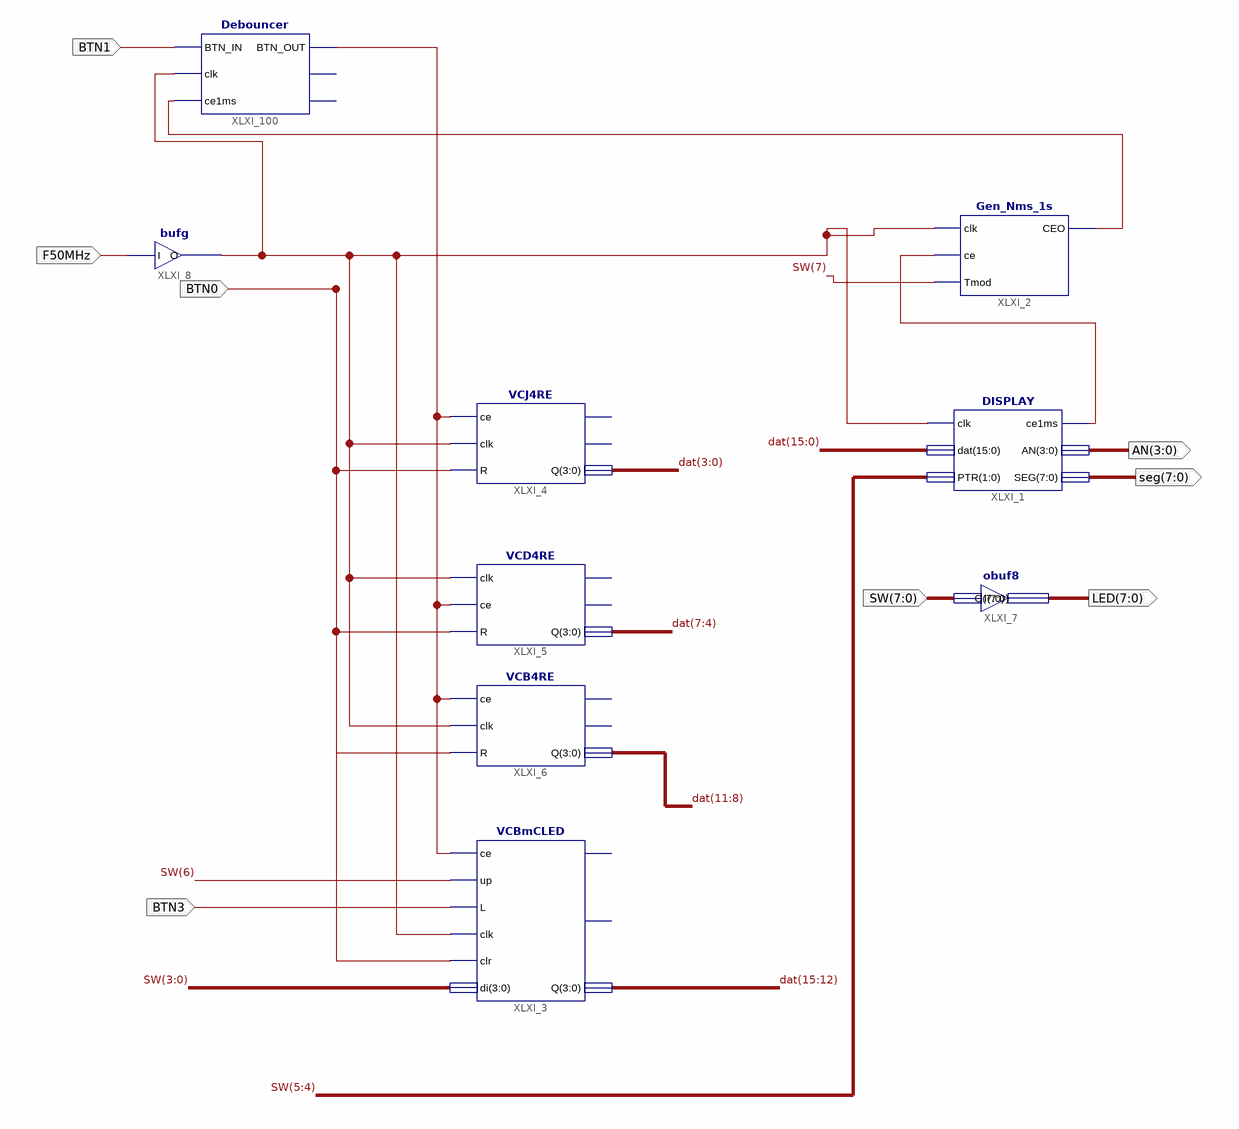
[diagram p0: schematic sheet 1]
// Xilinx ISE schematic Sch1_lab401.sch (spartan3e) as structural Verilog: 9 symbols, 8 ports
module Sch1_lab401 (
  input  BTN0,
  input  BTN3,
  input  [7:0] SW,
  input  BTN1,
  input  F50MHz,
  output [3:0] AN,
  output [7:0] seg,
  output [7:0] LED
);

  wire XLXN_59, XLXN_68, XLXN_86, XLXN_189;
  wire [15:0] dat;

  DISPLAY XLXI_1 (.clk(XLXN_68), .dat(dat), .PTR(SW[5:4]), .ce1ms(XLXN_59), .AN(AN), .SEG(seg));
  Gen_Nms_1s XLXI_2 (.clk(XLXN_68), .ce(XLXN_59), .Tmod(SW[7]), .CEO(XLXN_86));
  VCBmCLED XLXI_3 (
    .ce(XLXN_189), .up(SW[6]), .L(BTN3), .clk(XLXN_68), .clr(BTN0), .di(SW[3:0]), .Q(dat[15:12]));  // open: CEO, TC
  VCJ4RE XLXI_4 (.ce(XLXN_189), .clk(XLXN_68), .R(BTN0), .Q(dat[3:0]));  // open: TC, CEO
  VCB4RE XLXI_6 (.ce(XLXN_189), .clk(XLXN_68), .R(BTN0), .Q(dat[11:8]));  // open: TC, CEO
  obuf8 XLXI_7 (.I(SW), .O(LED));
  Debouncer XLXI_100 (.BTN_IN(BTN1), .clk(XLXN_68), .ce1ms(XLXN_86), .BTN_OUT(XLXN_189));  // open: Q1, Q2
  bufg XLXI_8 (.I(F50MHz), .O(XLXN_68));
  VCD4RE XLXI_5 (.clk(XLXN_68), .ce(XLXN_189), .R(BTN0), .Q(dat[7:4]));  // open: TC, CEO
endmodule
